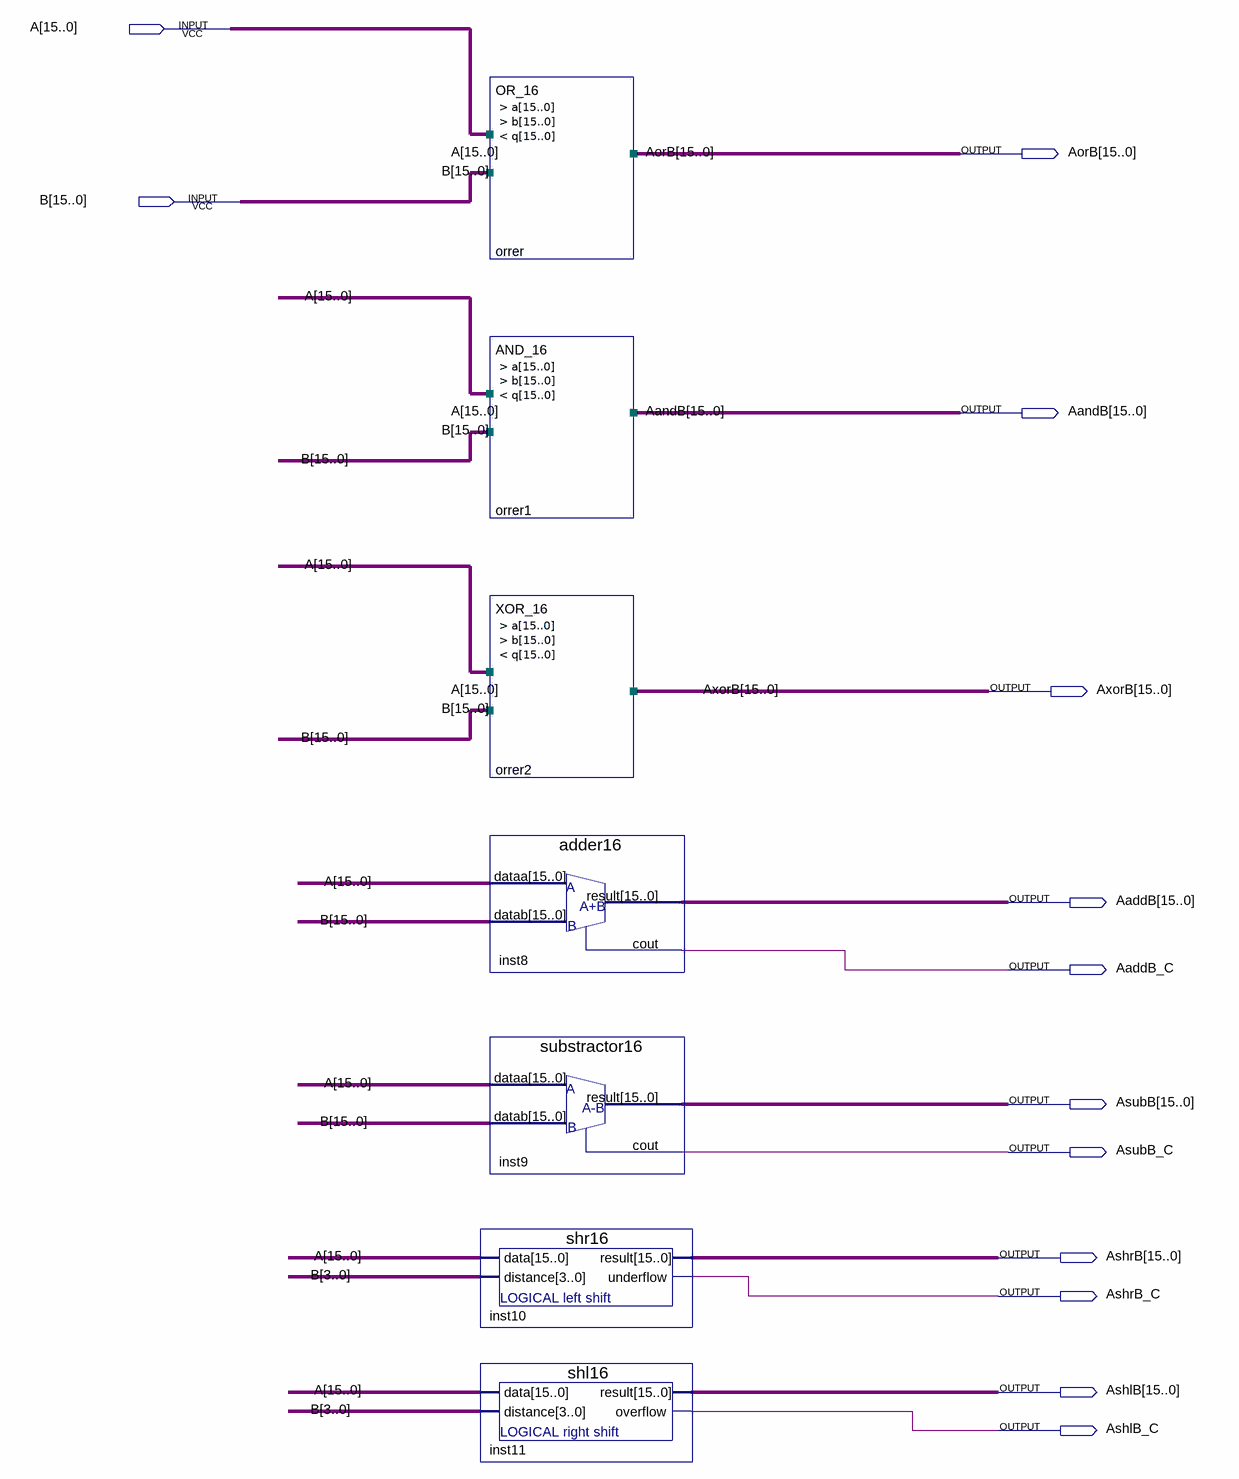
[diagram p0: schematic sheet]
// Quartus schematic CalcU.bdf as structural Verilog: 7 symbols, 13 pins
module CalcU (
  input  [15:0] A,
  input  [15:0] B,
  output [15:0] AorB,
  output [15:0] AandB,
  output [15:0] AxorB,
  output [15:0] AaddB,
  output AaddB_C,
  output [15:0] AsubB,
  output AsubB_C,
  output [15:0] AshrB,
  output AshrB_C,
  output [15:0] AshlB,
  output AshlB_C
);

  shr16 inst10 (.data(A), .distance(B[3:0]), .result(AshrB), .underflow(AshrB_C));
  shl16 inst11 (.data(A), .distance(B[3:0]), .result(AshlB), .overflow(AshlB_C));
  OR_16 orrer (.a(A), .b(B), .q(AorB));
  AND_16 orrer1 (.a(A), .b(B), .q(AandB));
  XOR_16 orrer2 (.a(A), .b(B), .q(AxorB));
  adder16 inst8 (.dataa(A), .datab(B), .result(AaddB), .cout(AaddB_C));
  substractor16 inst9 (.dataa(A), .datab(B), .result(AsubB), .cout(AsubB_C));
endmodule
